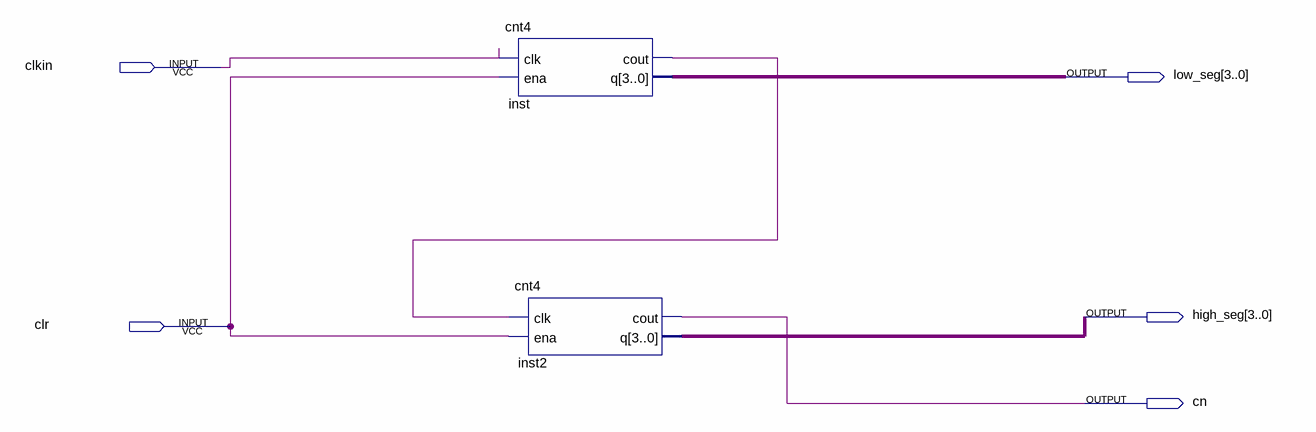
[diagram p0: schematic sheet]
// Quartus schematic bcd_counter.bdf as structural Verilog: 2 symbols, 5 pins
module bcd_counter (
  input  clkin,
  input  clr,
  output [3:0] low_seg,
  output [3:0] high_seg,
  output cn
);

  wire inst_cout;

  cnt4 inst (.clk(clkin), .ena(clr), .cout(inst_cout), .q(low_seg));
  cnt4 inst2 (.clk(inst_cout), .ena(clr), .cout(cn), .q(high_seg));
endmodule
